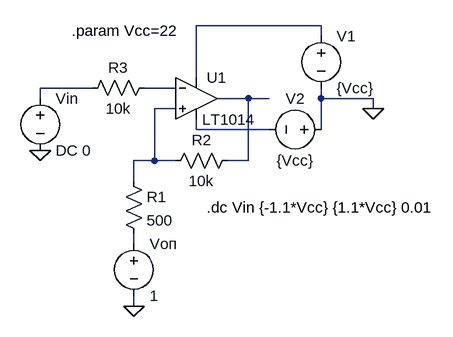
[diagram p0: schematic scheme8.asc]
scheme8.asc, the LTspice schematic file:
Version 4.1
SHEET 1 880 680
WIRE 400 -96 208 -96
WIRE 400 -80 400 -96
WIRE 208 -16 208 -96
WIRE 48 0 -32 0
WIRE 176 0 128 0
WIRE -32 16 -32 0
WIRE 288 16 240 16
WIRE 320 16 288 16
WIRE 400 16 400 0
WIRE 480 16 400 16
WIRE 176 32 144 32
WIRE 480 32 480 16
WIRE 208 64 208 48
WIRE 320 64 208 64
WIRE 400 64 400 16
WIRE 144 112 144 32
WIRE 144 112 112 112
WIRE 176 112 144 112
WIRE 288 112 288 16
WIRE 288 112 256 112
WIRE 112 144 112 112
WIRE 112 240 112 224
WIRE 112 336 112 320
FLAG 112 336 0
FLAG -32 96 0
FLAG 480 32 0
SYMBOL res 96 128 R0
SYMATTR InstName R1
SYMATTR Value 500
SYMBOL res 272 96 R90
WINDOW 0 0 56 VBottom 2
WINDOW 3 32 56 VTop 2
SYMATTR InstName R2
SYMATTR Value 10k
SYMBOL res 144 -16 R90
WINDOW 0 0 56 VBottom 2
WINDOW 3 32 56 VTop 2
SYMATTR InstName R3
SYMATTR Value 10k
SYMBOL OpAmps\\LT1014 208 -48 R0
WINDOW 3 9 97 Left 2
SYMATTR InstName U1
SYMBOL voltage 400 -96 R0
SYMATTR InstName V1
SYMATTR Value {Vcc}
SYMBOL voltage 416 64 R90
WINDOW 0 -32 56 VBottom 2
WINDOW 3 32 56 VTop 2
SYMATTR InstName V2
SYMATTR Value {Vcc}
SYMBOL voltage 112 224 R0
SYMATTR InstName Vоп
SYMATTR Value 1
SYMBOL voltage -32 0 R0
SYMATTR InstName Vin
SYMATTR Value DC 0
TEXT 16 -88 Left 2 !.param Vcc=22
TEXT 224 184 Left 2 !.dc Vin {-1.1*Vcc} {1.1*Vcc} 0.01

The netlist it stands for:
* scheme8.asc
R1 N005 N007 500
R2 N004 N005 10k
R3 N003 N002 10k
X§U1 N005 N003 N001 N006 N004 LT1014  ; pins In+ In- V+ V- OUT
V1 N001 0 {Vcc}
V2 0 N006 {Vcc}
Vоп N007 0 1
Vin N002 0 DC 0
.param Vcc=22
.dc Vin {-1.1*Vcc} {1.1*Vcc} 0.01
.backanno
.end